# Altium project XTRXr5.PRJPCB (part 2 of 2)

## Sheet Func Diagram.SchDoc: XTRX. SDR mini PCIe Transceiver.
size A2; CompanyName: Fairwaves Inc.; DrawnBy: Andrey Sviyazov; Revision: 4; SheetNumber: 1; SheetTotal: 5
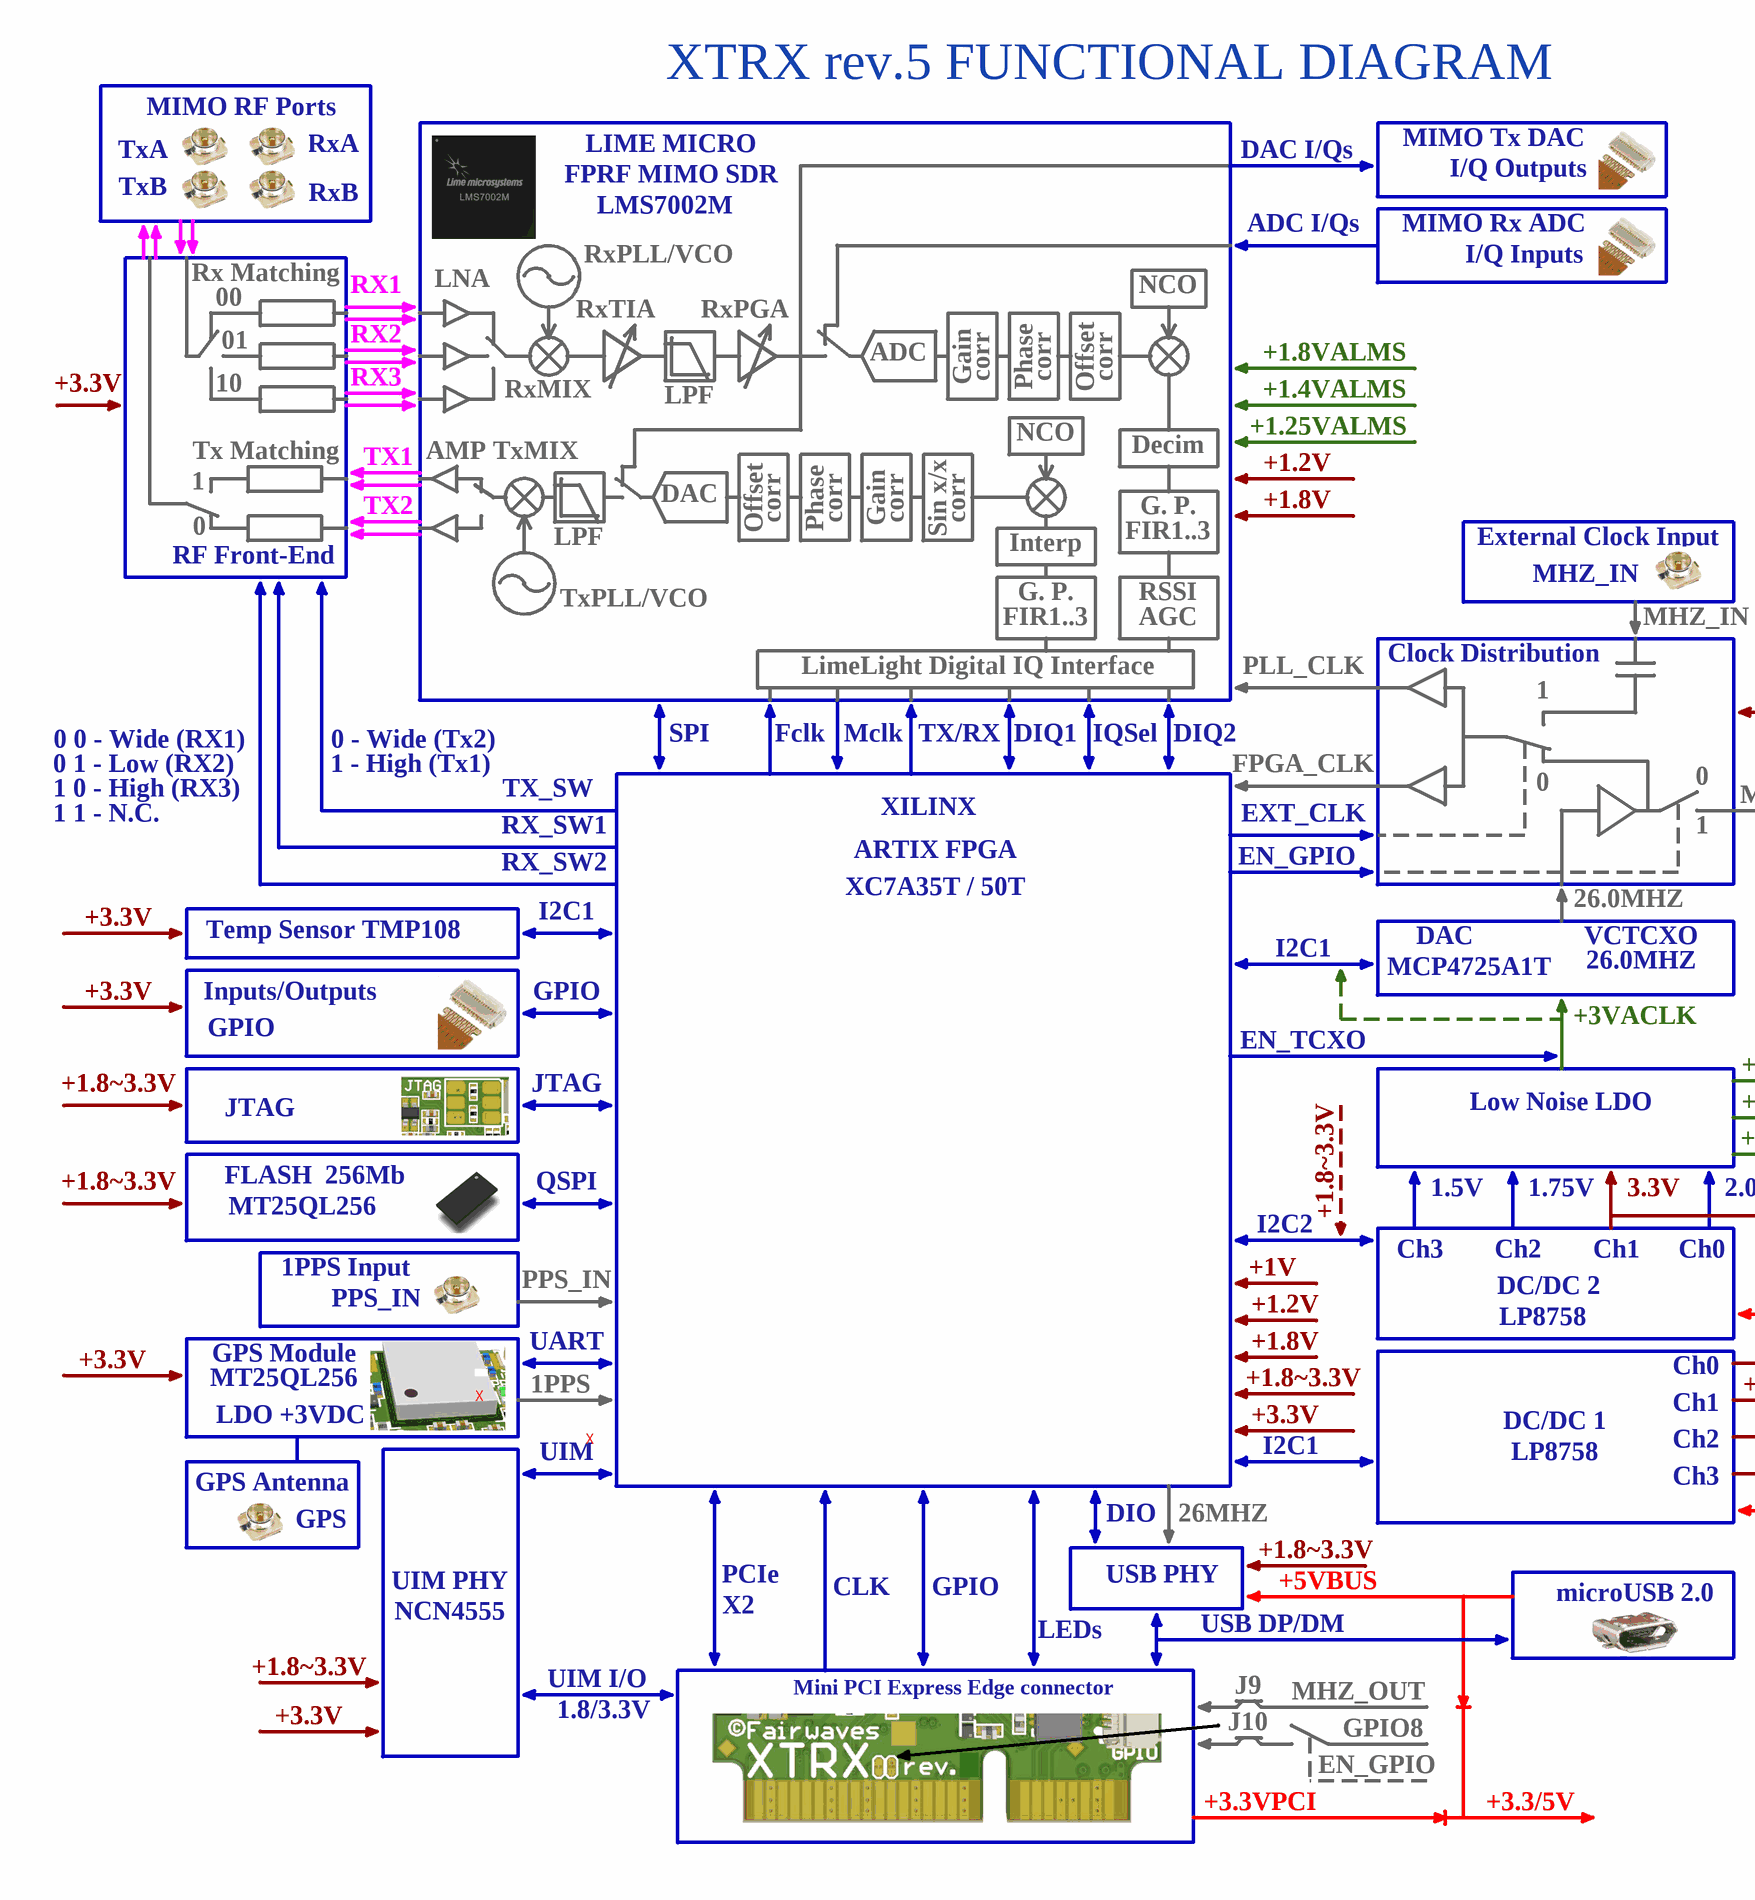
[diagram p4: Func Diagram.SchDoc, left]
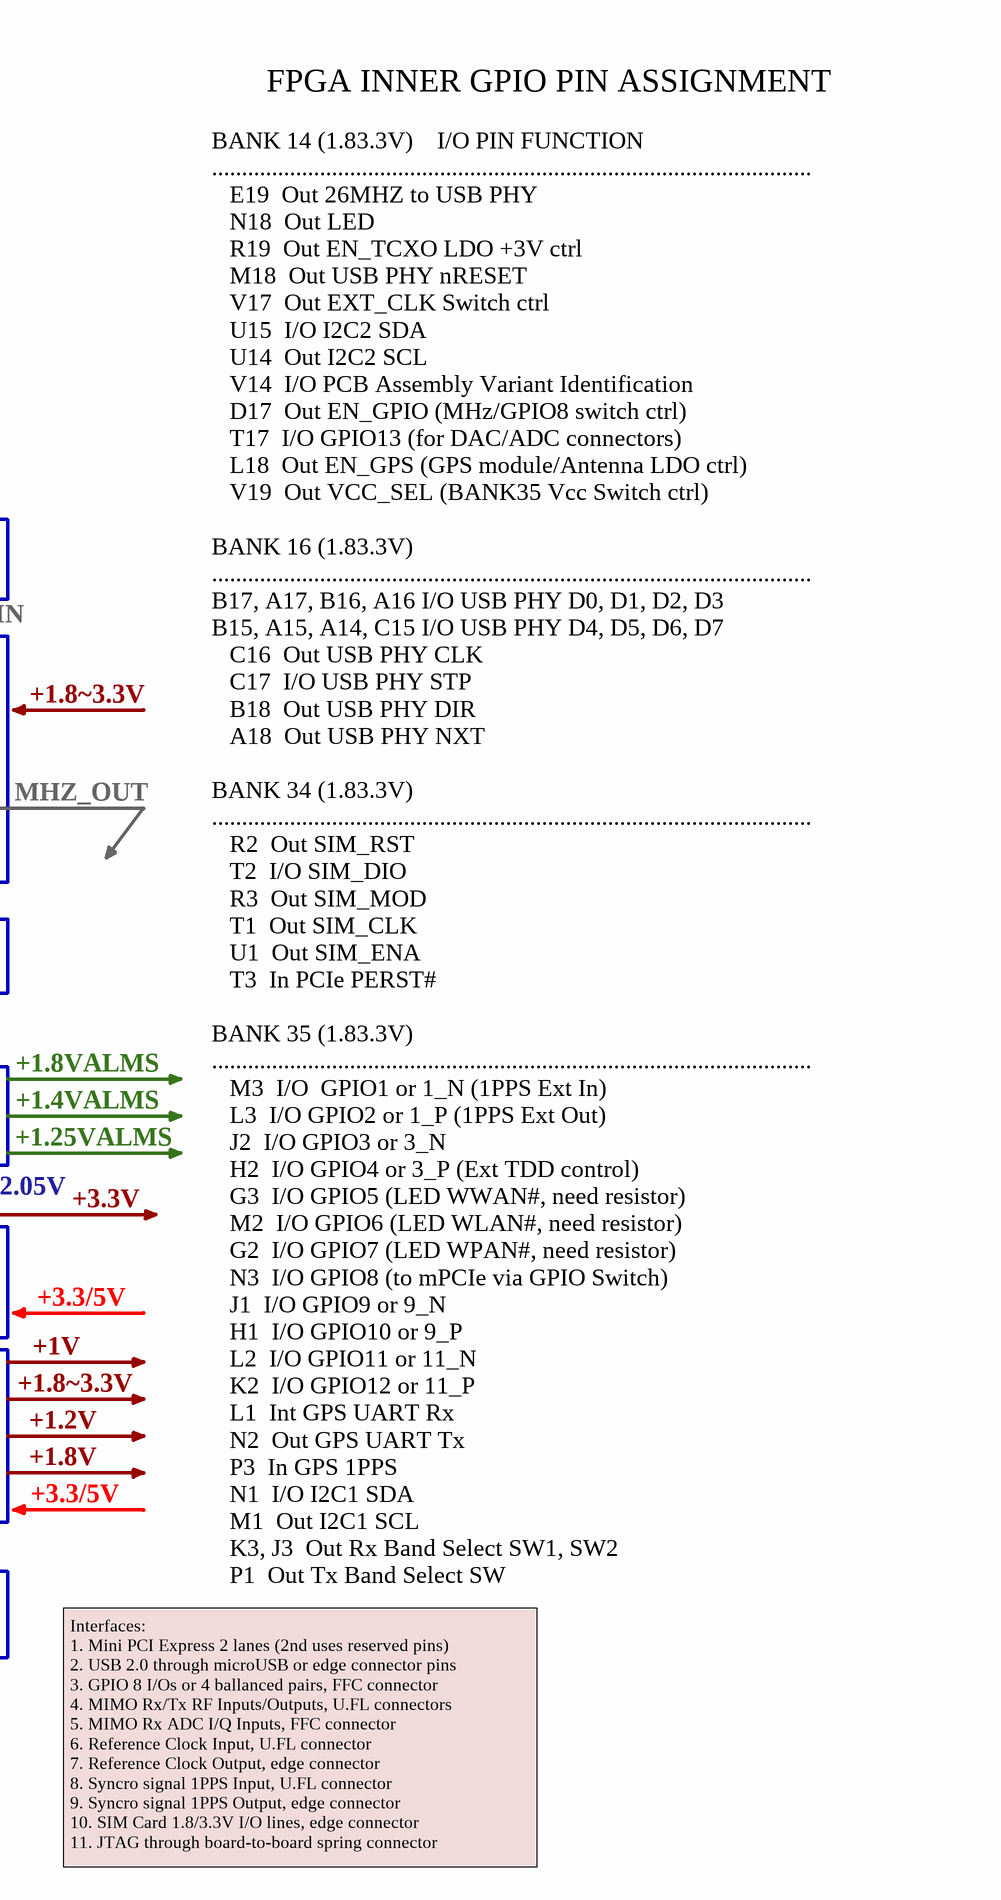
[diagram p5: Func Diagram.SchDoc, right]

### Notes on the sheet
- XTRX rev.5 FUNCTIONAL DIAGRAM
- FPGA INNER GPIO PIN ASSIGNMENT
- MIMO RF Ports
- RxA
- LIME MICRO
- MIMO Tx DAC
- TxA
- TxB
- RxB
- LMS7002M
- FPRF MIMO SDR
- DAC I/Qs
- I/Q Outputs
- RxPLL/VCO
- ADC I/Qs
- MIMO Rx ADC
- I/Q Inputs
- 00
- Rx Matching
- RX1
- RX2
- LNA
- RxTIA
- RxPGA
- NCO
- +3.3V
- 10
- 01
- RX3
- RxMIX
- ADC
- Gain
- corr
- Phase
- Offset
- +1.8VALMS
- +1.4VALMS
- Tx Matching
- TX1
- AMP
- TxMIX
- LPF
- Decim
- +1.25VALMS
- 1
- 0
- TX2
- DAC
- Sin x/x
- G. P.
- +1.2V
- +1.8V
- RF Front-End
- Interp
- FIR1..3
- MHZ_IN
- External Clock Input
- TxPLL/VCO
- RSSI
- AGC
- LimeLight Digital IQ Interface
- PLL_CLK
- Clock Distribution
- +1.8~3.3V
- 0 0 - Wide (RX1)
- 0 - Wide (Tx2)
- SPI
- Fclk
- Mclk
- TX/RX
- DIQ1
- IQSel
- DIQ2
- 1 1 - N.C.
- 0 1 - Low (RX2)
- 1 0 - High (RX3)
- 1 - High (Tx1)
- TX_SW
- RX_SW1
- XILINX
- EXT_CLK
- FPGA_CLK
- MHZ_OUT
- RX_SW2
- ARTIX FPGA
- EN_GPIO
- Temp Sensor TMP108
- I2C1
- XC7A35T / 50T
- 26.0MHZ
- VCTCXO
- Inputs/Outputs
- GPIO
- MCP4725A1T
- EN_TCXO
- +3VACLK
- JTAG
- Low Noise LDO
- FLASH  256Mb
- QSPI
- 1.5V
- 1.75V
- 3.3V
- 2.05V
- MT25QL256
- I2C2
- Ch3
- Ch2
- Ch1
- Ch0
- 1PPS Input
- PPS_IN
- +1V
- LP8758
- DC/DC 2
- +3.3/5V
- GPS Module
- Text
- UART
- LDO +3VDC
- X
- 1PPS
- DC/DC 1
- GPS Antenna
- UIM
- GPS
- DIO
- 26MHZ
- UIM PHY
- NCN4555
- X2
- PCIe
- CLK
- USB PHY
- +5VBUS
- microUSB 2.0
- BANK 14	(1.83.3V)    I/O	PIN FUNCTION
  ....................................................................................................
  E19		Out	26MHZ to USB PHY
  N18		Out	LED
  R19		Out	EN_TCXO LDO +3V ctrl
  M18		Out	USB PHY nRESET
  V17		Out	EXT_CLK Switch ctrl
  U15		I/O	I2C2 SDA
  U14		Out	I2C2 SCL
  V14		I/O	PCB Assembly Variant Identification
  D17		Out	EN_GPIO (MHz/GPIO8 switch ctrl)
  T17		I/O	GPIO13 (for DAC/ADC connectors)
  L18		Out	EN_GPS (GPS module/Antenna LDO ctrl)
  V19		Out	VCC_SEL (BANK35 Vcc Switch ctrl)
  BANK 16	(1.83.3V)
  ....................................................................................................
  B17, A17, B16, A16	I/O	USB PHY D0, D1, D2, D3
  B15, A15, A14, C15	I/O	USB PHY D4, D5, D6, D7
  C16		Out	USB PHY CLK
  C17		I/O	USB PHY STP
  B18		Out	USB PHY DIR
  A18		Out	USB PHY NXT
  BANK 34 (1.83.3V)
  ....................................................................................................
  R2		Out	SIM_RST
  T2		I/O	SIM_DIO
  R3		Out	SIM_MOD
  T1		Out	SIM_CLK
  U1		Out	SIM_ENA
  T3		In	PCIe PERST#
  BANK 35 (1.83.3V)
  ....................................................................................................
  M3		I/O 	GPIO1 or 1_N (1PPS Ext In)
  L3		I/O	GPIO2 or 1_P (1PPS Ext Out)
  J2		I/O	GPIO3 or 3_N
  H2		I/O	GPIO4 or 3_P (Ext TDD control)
  G3		I/O	GPIO5 (LED WWAN#, need resistor)
  M2		I/O	GPIO6 (LED WLAN#, need resistor)
  G2		I/O	GPIO7 (LED WPAN#, need resistor)
  N3		I/O	GPIO8 (to mPCIe via GPIO Switch)
  J1		I/O	GPIO9 or 9_N
  H1		I/O	GPIO10 or 9_P
  L2		I/O	GPIO11 or 11_N
  K2		I/O	GPIO12 or 11_P
  L1		Int	GPS UART Rx
  N2		Out	GPS UART Tx
  P3		In	GPS 1PPS
  N1		I/O	I2C1 SDA
  M1		Out	I2C1 SCL
  K3, J3		Out	Rx Band Select SW1, SW2
  P1		Out	Tx Band Select SW
- UIM I/O
- Mini PCI Express Edge connector
- LEDs
- J9
- USB DP/DM
- 1.8/3.3V
- J10
- GPIO8
- 5
- +3.3VPCI
- Interfaces:
  1. Mini PCI Express 2 lanes (2nd uses reserved pins)
  2. USB 2.0 through microUSB or edge connector pins
  3. GPIO 8 I/Os or 4 ballanced pairs, FFC connector
  4. MIMO Rx/Tx RF Inputs/Outputs, U.FL connectors
  5. MIMO Rx ADC I/Q Inputs, FFC connector
  6. Reference Clock Input, U.FL connector
  7. Reference Clock Output, edge connector
  8. Syncro signal 1PPS Input, U.FL connector
  9. Syncro signal 1PPS Output, edge connector
  10. SIM Card 1.8/3.3V I/O lines, edge connector
  11. JTAG through board-to-board spring connector

## Nets that join several sheets
+1.2V_MGTAVTT: PwrAndBias (8 pins), FPGA (R58.2)
+1.8/3.3VCCIO: PwrAndBias (49 pins), FPGA (21 pins)
+3,3V: PwrAndBias (5 pins), FPGA (5 pins)
+3.3/5VIN: PwrAndBias (29 pins), FPGA (7 pins)
+3V_VACLK: PwrAndBias (6 pins), FPGA (C11.2 L1.2 U27.A1)
GND: Total (7 pins), PwrAndBias (237 pins), FPGA (120 pins)
1PPS_IN: Total (X6.1), FPGA (R80.1)
GPS_ANT: Total (X5.1), FPGA (L4.2 U13.3)
MHZ_IN: Total (X7.1), FPGA (C28.2 ESD1.1 X10.19)
PCI_PERST#: PwrAndBias (R63.2 U19.C5 U19.D3 U19.D4), FPGA (R59.1 X10.22)
SCL1: PwrAndBias (R61.2 U19.E5), FPGA (U1.M1 U5.5 U5.6 U6.B2)
SCL2: PwrAndBias (R62.2 U20.E5), FPGA (U1.U14)
SDA1: PwrAndBias (R65.2 U19.D5), FPGA (U1.N1 U5.7 U6.B1 U6.C2)
SDA2: PwrAndBias (R66.2 U20.D5), FPGA (U1.U15)
VCC_SEL: PwrAndBias (U29.B1), FPGA (U1.V19)

## Assembly variants
Var 3_3V_I: not fitted C173 C174 C185 C186 C187 C188 C195 C196 C197 C198 C199 C200 C213 C214 L67 L68 L69 L70 R19 R36` U8
Var 1_8V_C: not fitted C173 C174 C185 C186 C187 C188 C195 C196 C197 C198 C199 C200 C213 C214 L67 L68 L69 L70 R26 R36` U8
Var 3_3V_C: not fitted C173 C174 C185 C186 C187 C188 C195 C196 C197 C198 C199 C200 C213 C214 L67 L68 L69 L70 R36` R85 U8